# Altium project PowerBoard.PrjPcb
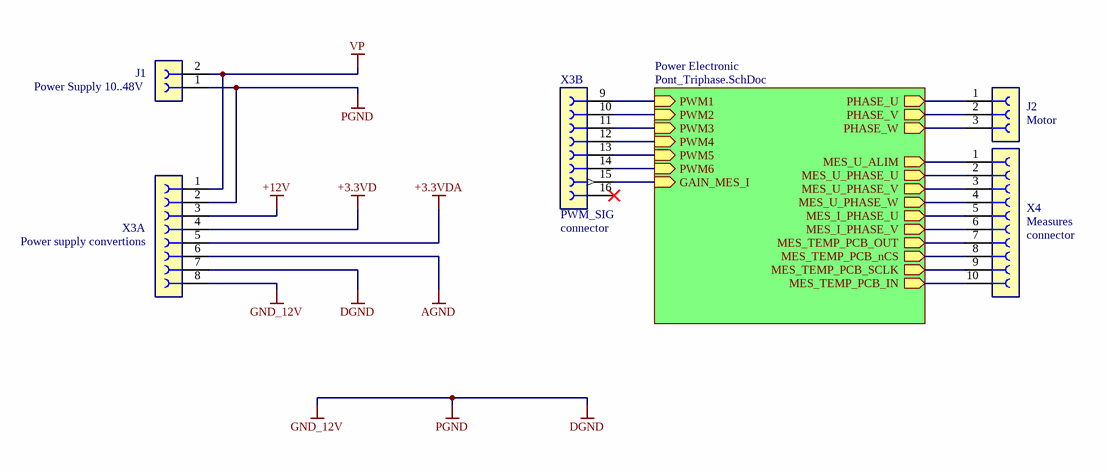
[diagram p0: PowerBoard.SchDoc]
ProjectAuthor: Joan Bommottet; ProjectiAiTitle: Driver Brushless; ProjectNumber: -; ProjectVersion: 1.0.0; ProjectVersionForDoc: 1_0_0
2 sheets, 96 parts. Net scope: hierarchical (ports join the sheet entries above them; power ports are global).
Board file: PowerBoard.PcbDoc
Sheets:
  PowerBoard.SchDoc
    Power Electronic = Pont_Triphase.SchDoc

## Sheet PowerBoard.SchDoc: Powerboard interface
size A4; Author: Joan Bommottet; Organization: Institut d'Automatisation Industrielle; SheetNumber: 1; SheetTotal: 2; SVN: OUI; Version: 1.0.0; NoProject: -; ProjectTitle: Driver Brushless; CurrentTime: 6; CurrentDate: 5; DocumentFullPathAndName: 8; DocumentName: 9; ModifiedDate: 13; ProjectName: <projet>

### Parts
J1  Use: Power Supply 10..48V  [CONNECT2PIN]  (hidden comment: CONNECT 2pos 90°)
J2  Use: Motor  [CONNECT3PIN]  (hidden comment: CONNECT 3pos 90°)
X3  Use: Power supply convertions  [62301621021]  (hidden comment: CONNECT SMD 16pos 2row 180°)  (parts A,B of 2)
X4  Use: Measures  system: connector  [62301021021]  (hidden comment: CONNECT SMD 10pos 2row 180°)

### Sub-sheets
Power Electronic = Pont_Triphase.SchDoc: MES_I_PHASE_U (out), MES_I_PHASE_V (out), PHASE_W (out), MES_U_ALIM (out), MES_U_PHASE_W (out), PHASE_V (out), PHASE_U (out), PWM2 (in), PWM3 (in), PWM4 (in), PWM5 (in), PWM1 (in), PWM6 (in), MES_U_PHASE_U (out), MES_U_PHASE_V (out), MES_TEMP_PCB_nCS (out), MES_TEMP_PCB_SCLK (out), MES_TEMP_PCB_OUT (out), MES_TEMP_PCB_IN (out), GAIN_MES_I (in)

### Nets
+3.3VD: X3.4
+3.3VDA: X3.5
+12V: X3.3
AGND: X3.6
DGND: J1.1 X3.2 X3.7 X3.8  [also labelled GND_12V, PGND]
VP: J1.2 X3.1
GAIN_MES_I: X3.15 ; sheet Power Electronic/GAIN_MES_I
Phase W: J2.3 ; sheet Power Electronic/PHASE_W
NetJ2_1: J2.1 ; sheet Power Electronic/PHASE_U
NetJ2_2: J2.2 ; sheet Power Electronic/PHASE_V
NetR4_1: X3.9 ; sheet Power Electronic/PWM1
NetR8_1: X3.10 ; sheet Power Electronic/PWM2
NetR9_2: X4.6 ; sheet Power Electronic/MES_I_PHASE_V
NetR11_1: X3.11 ; sheet Power Electronic/PWM3
NetR16_1: X3.12 ; sheet Power Electronic/PWM4
NetR18_2: X4.5 ; sheet Power Electronic/MES_I_PHASE_U
NetR22_1: X3.13 ; sheet Power Electronic/PWM5
NetR25_1: X3.14 ; sheet Power Electronic/PWM6
NetU1_2: X4.10 ; sheet Power Electronic/MES_TEMP_PCB_IN
NetU1_4: X4.9 ; sheet Power Electronic/MES_TEMP_PCB_SCLK
NetU1_5: X4.8 ; sheet Power Electronic/MES_TEMP_PCB_nCS
NetU1_6: X4.7 ; sheet Power Electronic/MES_TEMP_PCB_OUT
NetU2_1: X4.1 ; sheet Power Electronic/MES_U_ALIM
NetU2_5: X4.4 ; sheet Power Electronic/MES_U_PHASE_W
NetU2_8: X4.3 ; sheet Power Electronic/MES_U_PHASE_V
NetU2_13: X4.2 ; sheet Power Electronic/MES_U_PHASE_U

Not connected (* = marked no-connect by the designer): X3 16*

### Notes on the sheet
- Title
- Institut d'automatisation industrielle
  rte de Cheseaux 1
  CH-1401 Yverdon-les-Bains
  T +41(0)24 55 77 377    F +41(0)24 55 76 320
  http://iai.heig-vd.ch       iai@heig-vd.ch
- Date:
- Size:
- A4
- Project:
- Sheet
- of
- No.
- Author:
- SVN
- Version
- File:

### Library data of the parts
J1 = CONNECT 2pos 90° 3.81mm: 2 Positions, bloc de jonction Embase, broche mâle, gainée (4 côtés) 0,150 po (3,81mm) 90°, engle droit Trou traversant; Value: WR-TBL322; Supplier 1: Digi-Key; Supplier Part Number 1: 277-2315-1-ND
J2 = CONNECT 3pos 90° 3.81mm: 3 Positions, bloc de jonction Embase, broche mâle, gainée (4 côtés) 0,150 po (3,81mm) 90°, engle droit Trou traversant; Value: WR-TBL322; Supplier 1: Digi-Key; Supplier Part Number 1: 277-2316-1-ND
X3 = CONNECT SMD 16pos 180° 1.27mm 2row: Value: 62301621021; Supplier 1: Newark; Supplier Part Number 1: 47AC7230
X4 = CONNECT SMD 10pos 180° 1.27mm 2row: Value: 62301021021; Supplier 1: RSComponents; Supplier Part Number 1: 2053195

## Sheet Pont_Triphase.SchDoc: Three-phase bridge
size A2; Author: Joan Bommottet; Organization: Institut d'Automatisation Industrielle; SheetNumber: 2; SheetTotal: 2; SVN: OUI; Version: 1.0.0; NoProject: -; ProjectTitle: Driver Brushless; CurrentTime: 6; CurrentDate: 5; DocumentFullPathAndName: 8; DocumentName: 9; ModifiedDate: 13; ProjectName: <projet>
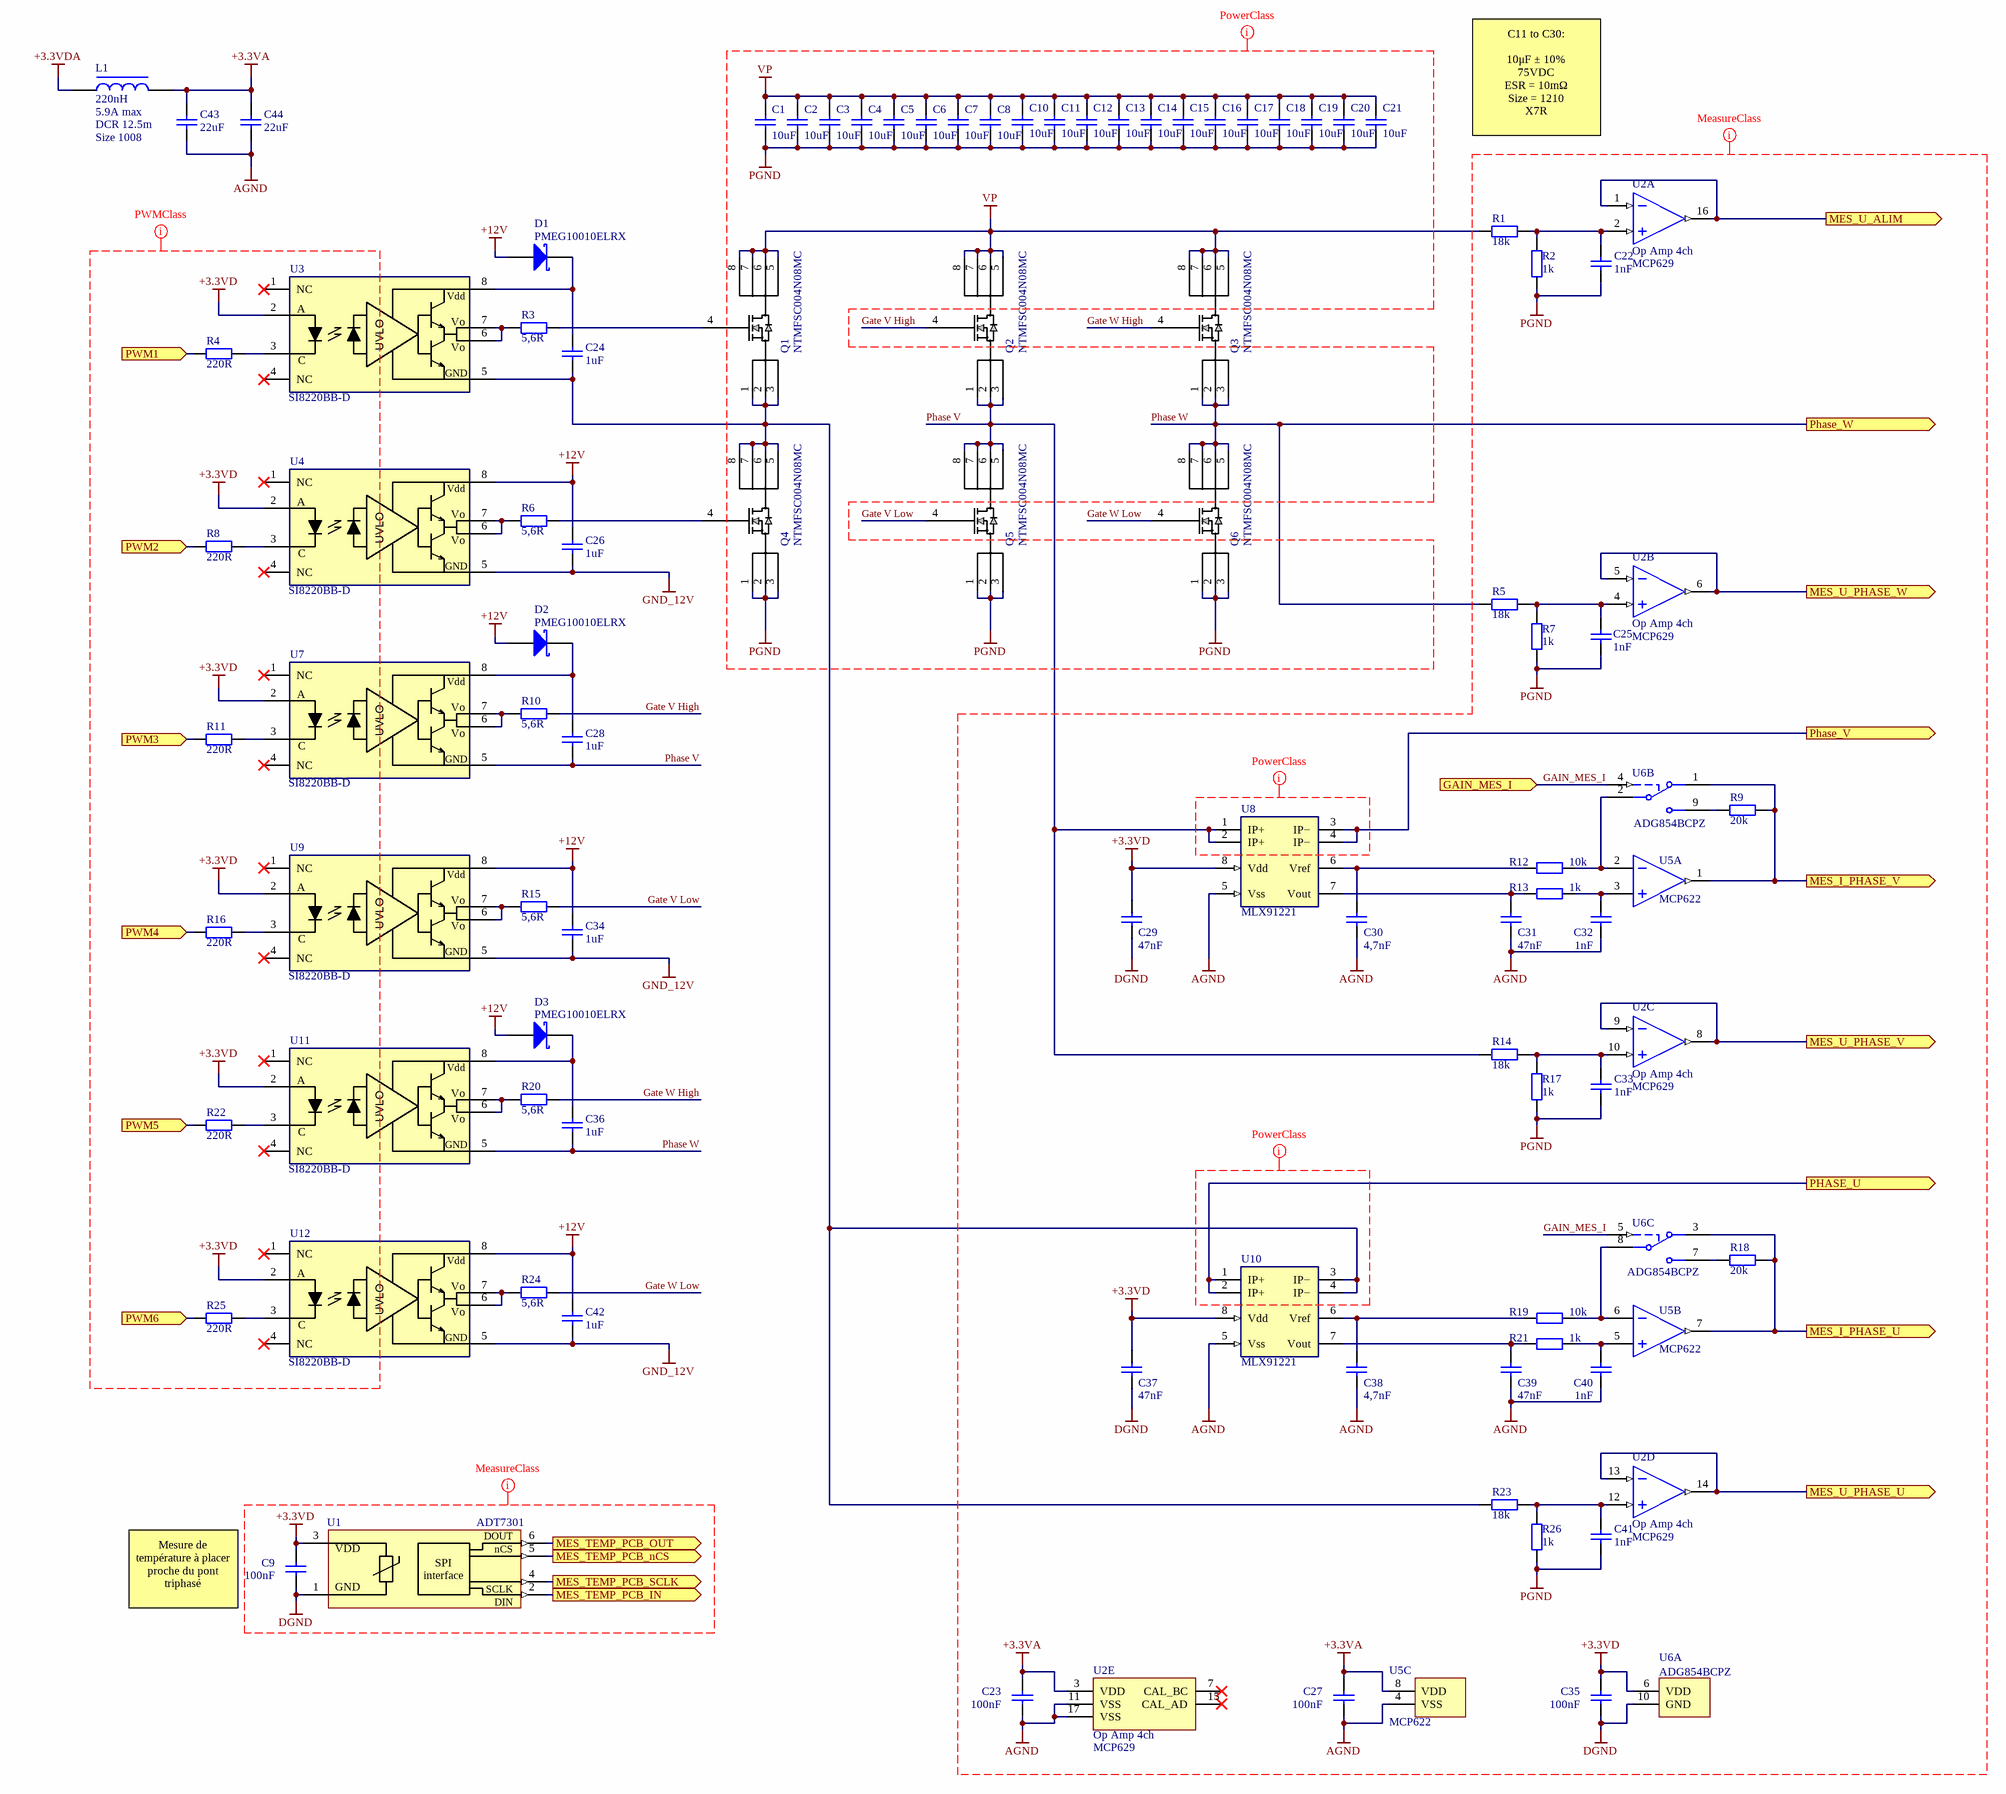
[diagram p1: Pont_Triphase.SchDoc]

### Parts
C1  value 10uF  [CAPC3226X25N]  (hidden comment: CAP CER 10uF 1210)
C2  value 10uF  [CAPC3226X25N]  (hidden comment: CAP CER 10uF 1210)
C3  value 10uF  [CAPC3226X25N]  (hidden comment: CAP CER 10uF 1210)
C4  value 10uF  [CAPC3226X25N]  (hidden comment: CAP CER 10uF 1210)
C5  value 10uF  [CAPC3226X25N]  (hidden comment: CAP CER 10uF 1210)
C6  value 10uF  [CAPC3226X25N]  (hidden comment: CAP CER 10uF 1210)
C7  value 10uF  [CAPC3226X25N]  (hidden comment: CAP CER 10uF 1210)
C8  value 10uF  [CAPC3226X25N]  (hidden comment: CAP CER 10uF 1210)
C9  value 100nF  [CAPC1608X08N]  (hidden comment: CAP CER 100nF 0603)
C10  value 10uF  [CAPC3226X25N]  (hidden comment: CAP CER 10uF 1210)
C11  value 10uF  [CAPC3226X25N]  (hidden comment: CAP CER 10uF 1210)
C12  value 10uF  [CAPC3226X25N]  (hidden comment: CAP CER 10uF 1210)
C13  value 10uF  [CAPC3226X25N]  (hidden comment: CAP CER 10uF 1210)
C14  value 10uF  [CAPC3226X25N]  (hidden comment: CAP CER 10uF 1210)
C15  value 10uF  [CAPC3226X25N]  (hidden comment: CAP CER 10uF 1210)
C16  value 10uF  [CAPC3226X25N]  (hidden comment: CAP CER 10uF 1210)
C17  value 10uF  [CAPC3226X25N]  (hidden comment: CAP CER 10uF 1210)
C18  value 10uF  [CAPC3226X25N]  (hidden comment: CAP CER 10uF 1210)
C19  value 10uF  [CAPC3226X25N]  (hidden comment: CAP CER 10uF 1210)
C20  value 10uF  [CAPC3226X25N]  (hidden comment: CAP CER 10uF 1210)
C21  value 10uF  [CAPC3226X25N]  (hidden comment: CAP CER 10uF 1210)
C22  value 1nF  [CAPC1608X08N]  (hidden comment: CAP CER 1nF 0603)
C23  value 100nF  [CAPC1608X08N]  (hidden comment: CAP CER 100nF 0603)
C24  value 1uF  [CAPC1608X08N]  (hidden comment: CAP CER 1uF 0603)
C25  value 1nF  [CAPC1608X08N]  (hidden comment: CAP CER 1nF 0603)
C26  value 1uF  [CAPC1608X08N]  (hidden comment: CAP CER 1uF 0603)
C27  value 100nF  [CAPC1608X08N]  (hidden comment: CAP CER 100nF 0603)
C28  value 1uF  [CAPC1608X08N]  (hidden comment: CAP CER 1uF 0603)
C29  value 47nF  [CAPC1608X08N]  (hidden comment: CAP CER 47nF 0603)
C30  value 4,7nF  [CAPC1608X08N]  (hidden comment: CAP CER 4.7nF 0603)
C31  value 47nF  [CAPC1608X08N]  (hidden comment: CAP CER 47nF 0603)
C32  value 1nF  [CAPC1608X08N]  (hidden comment: CAP CER 1nF 0603)
C33  value 1nF  [CAPC1608X08N]  (hidden comment: CAP CER 1nF 0603)
C34  value 1uF  [CAPC1608X08N]  (hidden comment: CAP CER 1uF 0603)
C35  value 100nF  [CAPC1608X08N]  (hidden comment: CAP CER 100nF 0603)
C36  value 1uF  [CAPC1608X08N]  (hidden comment: CAP CER 1uF 0603)
C37  value 47nF  [CAPC1608X08N]  (hidden comment: CAP CER 47nF 0603)
C38  value 4,7nF  [CAPC1608X08N]  (hidden comment: CAP CER 4.7nF 0603)
C39  value 47nF  [CAPC1608X08N]  (hidden comment: CAP CER 47nF 0603)
C40  value 1nF  [CAPC1608X08N]  (hidden comment: CAP CER 1nF 0603)
C41  value 1nF  [CAPC1608X08N]  (hidden comment: CAP CER 1nF 0603)
C42  value 1uF  [CAPC1608X08N]  (hidden comment: CAP CER 1uF 0603)
C43  value 22uF  [CAPC1608X08N]  (hidden comment: CAP CER 22uF 0603)
C44  value 22uF  [CAPC1608X08N]  (hidden comment: CAP CER 22uF 0603)
D1  value PMEG10010ELRX  [DIOM2617X11N]  (hidden comment: DIODE SCHOTTKY 100V 1A SOD123)
D2  value PMEG10010ELRX  [DIOM2617X11N]  (hidden comment: DIODE SCHOTTKY 100V 1A SOD123)
D3  value PMEG10010ELRX  [DIOM2617X11N]  (hidden comment: DIODE SCHOTTKY 100V 1A SOD123)
L1  value 220nH  Current: 5.9A max  DCR: DCR 12.5m  size: Size 1008  [INDC2520X10N]  (hidden comment: IND SMD 220nH 1008)
Q1  value NTMFSC004N08MC  [DFN8_506EG_ONS]  (hidden comment: MOSFET N-CH 80V)
Q2  value NTMFSC004N08MC  [DFN8_506EG_ONS]  (hidden comment: MOSFET N-CH 80V)
Q3  value NTMFSC004N08MC  [DFN8_506EG_ONS]  (hidden comment: MOSFET N-CH 80V)
Q4  value NTMFSC004N08MC  [DFN8_506EG_ONS]  (hidden comment: MOSFET N-CH 80V)
Q5  value NTMFSC004N08MC  [DFN8_506EG_ONS]  (hidden comment: MOSFET N-CH 80V)
Q6  value NTMFSC004N08MC  [DFN8_506EG_ONS]  (hidden comment: MOSFET N-CH 80V)
R1  value 18k  [RESC1508X04N]  (hidden comment: RES 18K SMD 0603)
R2  value 1k  [RESC1508X04N]  (hidden comment: RES 1K SMD 0603)
R3  value 5,6R  [RESC1508X04N]  (hidden comment: RES 5R6 SMD 0603)
R4  value 220R  [RESC1508X04N]  (hidden comment: RES 220R SMD 0603)
R5  value 18k  [RESC1508X04N]  (hidden comment: RES 18K SMD 0603)
R6  value 5,6R  [RESC1508X04N]  (hidden comment: RES 5R6 SMD 0603)
R7  value 1k  [RESC1508X04N]  (hidden comment: RES 1K SMD 0603)
R8  value 220R  [RESC1508X04N]  (hidden comment: RES 220R SMD 0603)
R9  value 20k  [RESC1508X04N]  (hidden comment: RES 20k SMD 0603)
R10  value 5,6R  [RESC1508X04N]  (hidden comment: RES 5R6 SMD 0603)
R11  value 220R  [RESC1508X04N]  (hidden comment: RES 220R SMD 0603)
R12  value 10k  [RESC1508X04N]  (hidden comment: RES 10K SMD 0603)
R13  value 1k  [RESC1508X04N]  (hidden comment: RES 1K SMD 0603)
R14  value 18k  [RESC1508X04N]  (hidden comment: RES 18K SMD 0603)
R15  value 5,6R  [RESC1508X04N]  (hidden comment: RES 5R6 SMD 0603)
R16  value 220R  [RESC1508X04N]  (hidden comment: RES 220R SMD 0603)
R17  value 1k  [RESC1508X04N]  (hidden comment: RES 1K SMD 0603)
R18  value 20k  [RESC1508X04N]  (hidden comment: RES 20k SMD 0603)
R19  value 10k  [RESC1508X04N]  (hidden comment: RES 10K SMD 0603)
R20  value 5,6R  [RESC1508X04N]  (hidden comment: RES 5R6 SMD 0603)
R21  value 1k  [RESC1508X04N]  (hidden comment: RES 1K SMD 0603)
R22  value 220R  [RESC1508X04N]  (hidden comment: RES 220R SMD 0603)
R23  value 18k  [RESC1508X04N]  (hidden comment: RES 18K SMD 0603)
R24  value 5,6R  [RESC1508X04N]  (hidden comment: RES 5R6 SMD 0603)
R25  value 220R  [RESC1508X04N]  (hidden comment: RES 220R SMD 0603)
R26  value 1k  [RESC1508X04N]  (hidden comment: RES 1K SMD 0603)
U1  value ADT7301  [SOT95P280X145-6N]  (hidden comment: SENSOR DIGITAL -40C-150C)
U2  Op Amp 4ch  value MCP629  [QFN65P400X400X100_HS-17N]  (parts A,B,C,D,E of 5)
U3  value SI8220BB-D  [SOIC127P600X175-8N]  (hidden comment: GATE DRIVER 2.5A)
U4  value SI8220BB-D  [SOIC127P600X175-8N]  (hidden comment: GATE DRIVER 2.5A)
U5  value MCP622  [QFN65P300X300X100_HS-9N]  (hidden comment: Op Amp 2ch)  (parts A,B,C of 3)
U6  value ADG854BCPZ  [QFN40P130X160X60-10N]  (hidden comment: Analog Switch 2:1 2ch)  (parts A,B,C of 3)
U7  value SI8220BB-D  [SOIC127P600X175-8N]  (hidden comment: GATE DRIVER 2.5A)
U8  value MLX91221  [SOIC127P600X173-8N]  (hidden comment: IC CURRENT SENSOR)
U9  value SI8220BB-D  [SOIC127P600X175-8N]  (hidden comment: GATE DRIVER 2.5A)
U10  value MLX91221  [SOIC127P600X173-8N]  (hidden comment: IC CURRENT SENSOR)
U11  value SI8220BB-D  [SOIC127P600X175-8N]  (hidden comment: GATE DRIVER 2.5A)
U12  value SI8220BB-D  [SOIC127P600X175-8N]  (hidden comment: GATE DRIVER 2.5A)

### Ports
GAIN_MES_I (in), MES_I_PHASE_U (out), MES_I_PHASE_V (out), MES_TEMP_PCB_IN (out), MES_TEMP_PCB_nCS (out), MES_TEMP_PCB_OUT (out), MES_TEMP_PCB_SCLK (out), MES_U_ALIM (out), MES_U_PHASE_U (out), MES_U_PHASE_V (out), MES_U_PHASE_W (out), PHASE_U (out), Phase_V (out), Phase_W (out), PWM1 (in), PWM2 (in), PWM3 (in), PWM4 (in), PWM5 (in), PWM6 (in)

### Nets
+3.3VA: C23.2 C27.2 C43.2 C44.2 L1.2 U2.3(VDD) U5.8(VDD)
+3.3VD: C9.2 C29.2 C35.2 C37.2 U1.3(VDD) U3.2(Anode) U4.2(Anode) U6.6(VDD) U7.2(Anode) U8.8(Vdd) U9.2(Anode) U10.8(Vdd) U11.2(Anode) U12.2(Anode)
+3.3VDA: L1.1
+12V: C26.2 C34.2 C42.2 D1.2(A) D2.2(A) D3.2(A) U4.8(Vdd) U9.8(Vdd) U12.8(Vdd)
AGND: C23.1 C27.1 C30.1 C31.1 C32.1 C38.1 C39.1 C40.1 C43.1 C44.1 U2.11(VSS) U2.17(VSS) U5.4(VSS) U8.5(Vss) U10.5(Vss)
DGND: C1.1 C2.1 C3.1 C4.1 C5.1 C6.1 C7.1 C8.1 C9.1 C10.1 C11.1 C12.1 C13.1 C14.1 C15.1 C16.1 C17.1 C18.1 C19.1 C20.1 C21.1 C22.1 C25.1 C26.1 C29.1 C33.1 C34.1 C35.1 C37.1 C41.1 C42.1 Q4.1 Q4.2 Q4.3 Q5.1 Q5.2 Q5.3 Q6.1 Q6.2 Q6.3 R2.1 R7.1 R17.1 R26.1 U1.1(GND) U4.5(Vss) U6.10(GND) U9.5(Vss) U12.5(Vss)  [also labelled GND_12V, PGND]
VP: C1.2 C2.2 C3.2 C4.2 C5.2 C6.2 C7.2 C8.2 C10.2 C11.2 C12.2 C13.2 C14.2 C15.2 C16.2 C17.2 C18.2 C19.2 C20.2 C21.2 Q1.5 Q1.6 Q1.7 Q1.8 Q2.5 Q2.6 Q2.7 Q2.8 Q3.5 Q3.6 Q3.7 Q3.8 R1.1
GAIN_MES_I: U6.4(IN1) U6.5(IN2) ; port GAIN_MES_I
Gate V High: Q2.4 R10.2
Gate V Low: Q5.4 R15.2
Gate W High: Q3.4 R20.2
Gate W Low: Q6.4 R24.2
Phase V: C28.1 Q2.1 Q2.2 Q2.3 Q5.5 Q5.6 Q5.7 Q5.8 R14.1 U7.5(Vss) U8.1(IP+) U8.2(IP+)
Phase W: C36.1 Q3.1 Q3.2 Q3.3 Q6.5 Q6.6 Q6.7 Q6.8 R5.1 U11.5(Vss) ; port Phase_W
NetC22_2: C22.2 R1.2 R2.2 U2.2(IN+)
NetC24_1: C24.1 Q1.1 Q1.2 Q1.3 Q4.5 Q4.6 Q4.7 Q4.8 R23.1 U3.5(Vss) U10.3(IP−) U10.4(IP−)
NetC24_2: C24.2 D1.1(K) U3.8(Vdd)
NetC25_2: C25.2 R5.2 R7.2 U2.4(IN+)
NetC28_2: C28.2 D2.1(K) U7.8(Vdd)
NetC30_2: C30.2 R12.1 U8.6(Vref)
NetC31_2: C31.2 R13.1 U8.7(Vout)
NetC32_2: C32.2 R13.2 U5.3(IN+)
NetC33_2: C33.2 R14.2 R17.2 U2.10(IN+)
NetC36_2: C36.2 D3.1(K) U11.8(Vdd)
NetC38_2: C38.2 R19.1 U10.6(Vref)
NetC39_2: C39.2 R21.1 U10.7(Vout)
NetC40_2: C40.2 R21.2 U5.5(IN+)
NetC41_2: C41.2 R23.2 R26.2 U2.12(IN+)
NetJ2_1: U10.1(IP+) U10.2(IP+) ; port PHASE_U
NetJ2_2: U8.3(IP−) U8.4(IP−) ; port Phase_V
NetQ1_4: Q1.4 R3.2
NetQ4_4: Q4.4 R6.2
NetR3_1: R3.1 U3.6(Vo) U3.7(Vo)
NetR4_1: R4.1 ; port PWM1
NetR4_2: R4.2 U3.3(Cathode)
NetR6_1: R6.1 U4.6(Vo) U4.7(Vo)
NetR8_1: R8.1 ; port PWM2
NetR8_2: R8.2 U4.3(Cathode)
NetR9_1: R9.1 U6.9(S2A)
NetR9_2: R9.2 U5.1(OUT) U6.1(S1A) ; port MES_I_PHASE_V
NetR10_1: R10.1 U7.6(Vo) U7.7(Vo)
NetR11_1: R11.1 ; port PWM3
NetR11_2: R11.2 U7.3(Cathode)
NetR12_2: R12.2 U5.2(IN-) U6.2(D1)
NetR15_1: R15.1 U9.6(Vo) U9.7(Vo)
NetR16_1: R16.1 ; port PWM4
NetR16_2: R16.2 U9.3(Cathode)
NetR18_1: R18.1 U6.7(S2B)
NetR18_2: R18.2 U5.7(OUT) U6.3(S1B) ; port MES_I_PHASE_U
NetR19_2: R19.2 U5.6(IN-) U6.8(D2)
NetR20_1: R20.1 U11.6(Vo) U11.7(Vo)
NetR22_1: R22.1 ; port PWM5
NetR22_2: R22.2 U11.3(Cathode)
NetR24_1: R24.1 U12.6(Vo) U12.7(Vo)
NetR25_1: R25.1 ; port PWM6
NetR25_2: R25.2 U12.3(Cathode)
NetU1_2: U1.2(DIN) ; port MES_TEMP_PCB_IN
NetU1_4: U1.4(SCLK) ; port MES_TEMP_PCB_SCLK
NetU1_5: U1.5(nCS) ; port MES_TEMP_PCB_nCS
NetU1_6: U1.6(DOUT) ; port MES_TEMP_PCB_OUT
NetU2_1: U2.1(IN-) U2.16(OUT) ; port MES_U_ALIM
NetU2_5: U2.5(IN-) U2.6(OUT) ; port MES_U_PHASE_W
NetU2_8: U2.8(OUT) U2.9(IN-) ; port MES_U_PHASE_V
NetU2_13: U2.13(IN-) U2.14(OUT) ; port MES_U_PHASE_U

Not connected (* = marked no-connect by the designer): U2 7(CAL_BC)* 15(CAL_AD)*; U3 1(NC)* 4(NC)*; U4 1(NC)* 4(NC)*; U7 1(NC)* 4(NC)*; U9 1(NC)* 4(NC)*; U11 1(NC)* 4(NC)*; U12 1(NC)* 4(NC)*

### Layout directives
net class PowerClass: (no net found under the mark), PGND, Phase V, Phase W, VP
net class MeasureClass: +3.3VA, +3.3VD, AGND, DGND, GAIN_MES_I, PGND
net class PWMClass: +3.3VD

### Notes on the sheet
- C11 to C30:
  10μF ± 10%
  75VDC
  ESR = 10mΩ
  Size = 1210
  X7R
- Mesure de température à placer proche du pont triphasé
- Title
- Institut d'automatisation industrielle
  rte de Cheseaux 1
  CH-1401 Yverdon-les-Bains
  T +41(0)24 55 77 377    F +41(0)24 55 76 320
  http://iai.heig-vd.ch       iai@heig-vd.ch
- Date:
- File:
- Size:
- A3
- Project:
- Sheet
- of
- No.
- Author:
- SVN
- Version
- (in symbol DGTL ISO 2.5KV GATE DRIVER 8SOIC) A; UVLO; C; GND
- (in symbol SENSOR DIGITAL -40C-150C SOT23-6) SPI; interface

### Library data of the parts
C1-C8 C10-C21 = CAP CER 10uF 10% 75V 1210: 10µF ±10% 75V Condensateurs céramique X7R 1210 (3225 métrique); Supplier 1: Digi-Key; Supplier Part Number 1: 445-181658-1-ND
C9 C23 C27 C35 = CAP CER 100nF 10% 10V 0603: 0,1µF ±10% 10V Condensateurs céramique X7R 0603 (1608 métrique); Supplier 1: Digi-Key; Supplier Part Number 1: 399-1095-1-ND
C22 C25 C32 C33 C40 C41 = CAP CER 1nF 10% 10V 0603: 1nF ±10% 10V Condensateurs céramique X7R 0603 (1608 métrique); Supplier 1: Digi-Key; Supplier Part Number 1: 399-8984-1-ND
C24 C26 C28 C34 C36 C42 = CAP CER 1uF 10% 16V 0603: 1µF ±10% 16V Condensateurs céramique X7R 0603 (1608 métrique); Supplier 1: Digi-Key; Supplier Part Number 1: 399-7847-1-ND
C29 C31 C37 C39 = CAP CER 47nF 10% 10V 0603: 47nF ±10% 10V Condensateurs céramique X7R 0603 (1608 métrique); Supplier 1: Mouser; Supplier Part Number 1: 80-C0603C473K8R
C30 C38 = CAP CER 4.7nF 10% 10V 0603: 4,7nF ±10% 10V Condensateurs céramique X7R 0603 (1608 métrique); Supplier 1: Digi-Key; Supplier Part Number 1: 399-9092-1-ND
C43 C44 = CAP CER 22uF 20% 6V3 0603: 22µF ±20% 6,3V Condensateurs céramique X5R 0603 (1608 métrique); Supplier 1: Digi-Key; Supplier Part Number 1: 399-14498-1-ND
D1-D3 = DIODE SCHOTTKY 100V 1A SOD123: Diode Schottky 100V 1A Montage en surface CFP3; Supplier 1: Digi-Key; Supplier Part Number 1: 1727-2394-1-ND
Q1-Q6 = MOSFET N-CH 80V 86A/136A 8DFN: Canal N 80V 86A (Ta), 136A (Tc) 51W (Ta), 127W (Tc) Montage en surface 8-DFN (5,1x6,15); Supplier 1: Digi-Key; Supplier Part Number 1: 488-NTMFSC004N08MCCT-ND
R1 R5 R14 R23 = RES SMD 18K OHM 1% 1/10W 0603: 18 kOhms ±1% 0,1W, 1/10W Pavé résistif 0603 (1608 métrique) AutomobileAEC-Q200 Couche épaisse; Supplier 1: Digi-Key; Supplier Part Number 1: RMCF0603FT18K0CT-ND
R2 R7 R13 R17 R21 R26 = RES SMD 1K OHM 1% 1/10W 0603: 1 kOhms ±1% 0,1W, 1/10W Pavé résistif 0603 (1608 métrique) AutomobileAEC-Q200 Couche épaisse; Supplier 1: Digi-Key; Supplier Part Number 1: RMCF0603FT1K00CT-ND
R3 R6 R10 R15 R20 R24 = RES SMD 5.6 OHM 1% 1/10W 0603: 5,6 Ohms ±1% 0,1W, 1/10W Pavé résistif 0603 (1608 métrique) AutomobileAEC-Q200 Couche épaisse; Supplier 1: DigiKey; Supplier Part Number 1: 738-RMCF0603FT5R60TR-ND
R4 R8 R11 R16 R22 R25 = RES SMD 220 OHM 1% 1/10W 0603: 220 Ohms ±1% 0,1W, 1/10W Pavé résistif 0603 (1608 métrique) AutomobileAEC-Q200 Couche épaisse; Supplier 1: Digi-Key; Supplier Part Number 1: RMCF0603FT220RCT-ND
R9 R18 = RES SMD 20K OHM 1% 1/10W 0603: 20 kOhms ±1% 0,1W, 1/10W Pavé résistif 0603 (1608 métrique) AutomobileAEC-Q200 Couche épaisse; Supplier 1: Digi-Key; Supplier Part Number 1: RMCF0603FT20K0CT-ND
R12 R19 = RES SMD 10K OHM 1% 1/10W 0603: 10 kOhms ±1% 0,1W, 1/10W Pavé résistif 0603 (1608 métrique) AutomobileAEC-Q200 Couche épaisse; Supplier 1: Digi-Key; Supplier Part Number 1: RMCF0603FT10K0CT-ND
U1 = SENSOR DIGITAL -40C-150C SOT23-6: Capteur de température Numérique, local -40°C ~ 150°C 13 b SOT-23-6; Supplier 1: Digi-Key; Supplier Part Number 1: ADT7301ARTZ-REEL7CT-ND
U2 = Op Amp 4ch: FET Operational Amplifier; ComponentLink1Description: Manufacturer Link; ComponentLink1URL: http://www.analog.com/
U3 U4 U7 U9 U11 U12 = DGTL ISO 2.5KV GATE DRIVER 8SOIC: 2.5A Gate Driver Capacitive Coupling 2500Vrms 1 Channel 8SOIC; Supplier 1: Newark; Supplier Part Number 1: 66AH7002
U5 = Op Amp 2ch: Amplificateurs opérationnels - Amplis-Op Dual 20MHz OP Auto-cal E temp; ComponentLink1Description: Manufacturer Link; ComponentLink1URL: http://www.analog.com/
U6 = IC SWITCH DUAL SPDT 10LFCSP: 2 Circuits, circuit intégré, commutateur 2:1 850mOhms 10-LFCSP-UQ (1,6x1,3)
U8 U10 = IC CURRENT SENSOR P&P 8SOIC: Current Sensor 20A 1 Channel Hall Effect Bidirectional 8-SOIC (0.154", 3.90mm Width); Supplier 1: Digi-Key; Supplier Part Number 1: 413-MLX91221KDC-ABF-025-SP-ND

## Nets that join several sheets
+3.3VD: PowerBoard (X3.4), Pont_Triphase (14 pins)
+3.3VDA: PowerBoard (X3.5), Pont_Triphase (L1.1)
+12V: PowerBoard (X3.3), Pont_Triphase (9 pins)
AGND: PowerBoard (X3.6), Pont_Triphase (15 pins)
DGND: PowerBoard (J1.1 X3.2 X3.7 X3.8), Pont_Triphase (49 pins)
VP: PowerBoard (J1.2 X3.1), Pont_Triphase (33 pins)
GAIN_MES_I: PowerBoard (X3.15), Pont_Triphase (U6.4 U6.5)
NetJ2_1: PowerBoard (J2.1), Pont_Triphase (U10.1 U10.2)
NetJ2_2: PowerBoard (J2.2), Pont_Triphase (U8.3 U8.4)
NetR4_1: PowerBoard (X3.9), Pont_Triphase (R4.1)
NetR8_1: PowerBoard (X3.10), Pont_Triphase (R8.1)
NetR9_2: PowerBoard (X4.6), Pont_Triphase (R9.2 U5.1 U6.1)
NetR11_1: PowerBoard (X3.11), Pont_Triphase (R11.1)
NetR16_1: PowerBoard (X3.12), Pont_Triphase (R16.1)
NetR18_2: PowerBoard (X4.5), Pont_Triphase (R18.2 U5.7 U6.3)
NetR22_1: PowerBoard (X3.13), Pont_Triphase (R22.1)
NetR25_1: PowerBoard (X3.14), Pont_Triphase (R25.1)
NetU1_2: PowerBoard (X4.10), Pont_Triphase (U1.2)
NetU1_4: PowerBoard (X4.9), Pont_Triphase (U1.4)
NetU1_5: PowerBoard (X4.8), Pont_Triphase (U1.5)
NetU1_6: PowerBoard (X4.7), Pont_Triphase (U1.6)
NetU2_1: PowerBoard (X4.1), Pont_Triphase (U2.1 U2.16)
NetU2_5: PowerBoard (X4.4), Pont_Triphase (U2.5 U2.6)
NetU2_8: PowerBoard (X4.3), Pont_Triphase (U2.8 U2.9)
NetU2_13: PowerBoard (X4.2), Pont_Triphase (U2.13 U2.14)
Phase W: PowerBoard (J2.3), Pont_Triphase (10 pins)